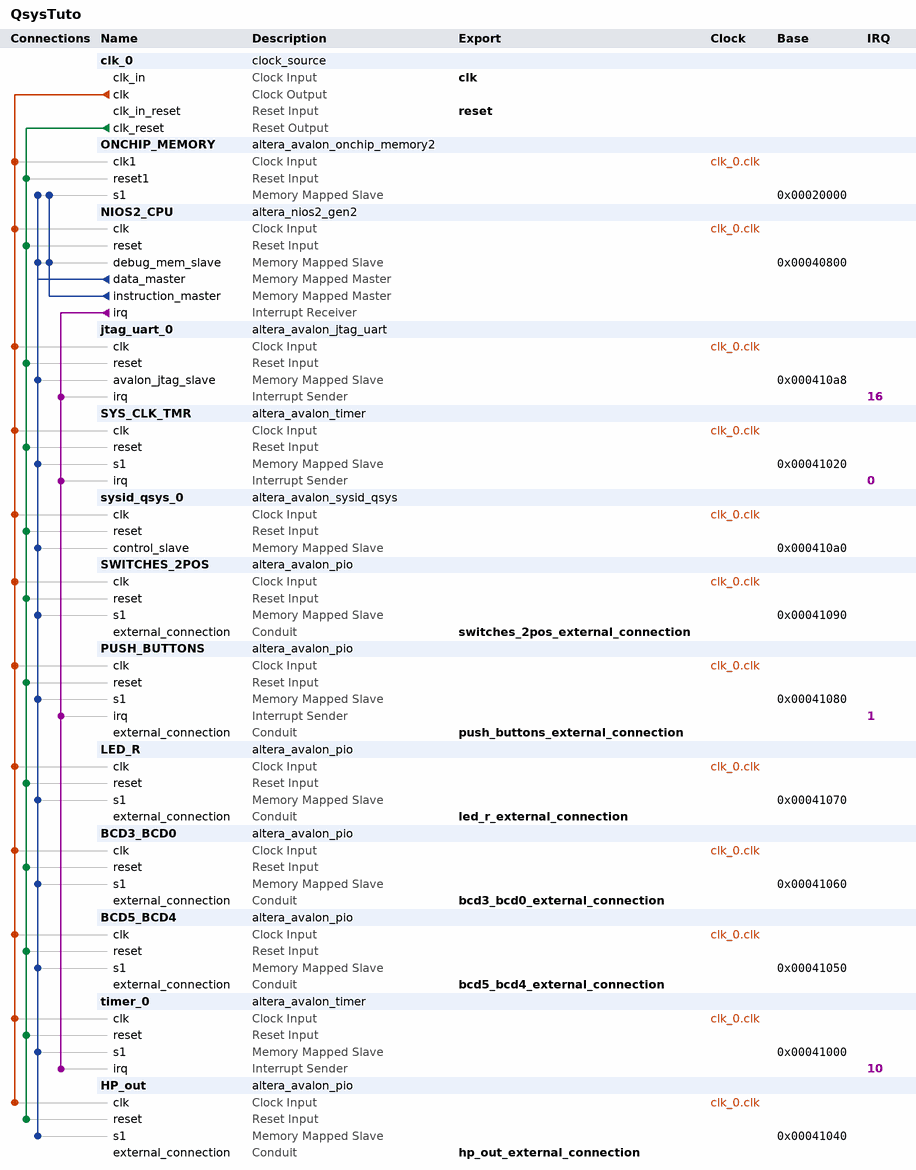
[diagram p0: system contents]
# Platform Designer (Qsys) system QsysTuto, MAX 10 10M50DAF484C6GES
# Parameters at their usual value, and those the tool derives, are not listed.
package require -exact qsys 18.1
create_system QsysTuto
set_project_property DEVICE_FAMILY {MAX 10}
set_project_property DEVICE 10M50DAF484C6GES

add_instance clk_0 clock_source 18.1
set_instance_parameter_value clk_0 clockFrequency 50000000

add_instance ONCHIP_MEMORY altera_avalon_onchip_memory2 18.1
set_instance_parameter_value ONCHIP_MEMORY dataWidth 32
set_instance_parameter_value ONCHIP_MEMORY dualPort false
set_instance_parameter_value ONCHIP_MEMORY initMemContent false
set_instance_parameter_value ONCHIP_MEMORY initializationFileName onchip_mem.hex
set_instance_parameter_value ONCHIP_MEMORY memorySize 122880

add_instance NIOS2_CPU altera_nios2_gen2 18.1
set_instance_parameter_value NIOS2_CPU dcache_size 0
set_instance_parameter_value NIOS2_CPU exceptionSlave ONCHIP_MEMORY.s1
set_instance_parameter_value NIOS2_CPU icache_size 2048
set_instance_parameter_value NIOS2_CPU impl Fast
set_instance_parameter_value NIOS2_CPU resetSlave ONCHIP_MEMORY.s1
set_instance_parameter_value NIOS2_CPU setting_branchpredictiontype Static

add_instance jtag_uart_0 altera_avalon_jtag_uart 18.1
set_instance_parameter_value jtag_uart_0 simInteractiveOptions NO_INTERACTIVE_WINDOWS

add_instance SYS_CLK_TMR altera_avalon_timer 18.1
set_instance_parameter_value SYS_CLK_TMR period 2
set_instance_parameter_value SYS_CLK_TMR periodUnits MSEC

add_instance sysid_qsys_0 altera_avalon_sysid_qsys 18.1
set_instance_parameter_value sysid_qsys_0 id -1430532899

add_instance SWITCHES_2POS altera_avalon_pio 18.1
set_instance_parameter_value SWITCHES_2POS direction Input
set_instance_parameter_value SWITCHES_2POS width 10

add_instance PUSH_BUTTONS altera_avalon_pio 18.1
set_instance_parameter_value PUSH_BUTTONS captureEdge true
set_instance_parameter_value PUSH_BUTTONS direction Input
set_instance_parameter_value PUSH_BUTTONS edgeType FALLING
set_instance_parameter_value PUSH_BUTTONS generateIRQ true
set_instance_parameter_value PUSH_BUTTONS irqType EDGE
set_instance_parameter_value PUSH_BUTTONS width 2

add_instance LED_R altera_avalon_pio 18.1
set_instance_parameter_value LED_R direction Output
set_instance_parameter_value LED_R resetValue 597
set_instance_parameter_value LED_R width 10

add_instance BCD3_BCD0 altera_avalon_pio 18.1
set_instance_parameter_value BCD3_BCD0 direction Output
set_instance_parameter_value BCD3_BCD0 resetValue 1077952576
set_instance_parameter_value BCD3_BCD0 width 32

add_instance BCD5_BCD4 altera_avalon_pio 18.1
set_instance_parameter_value BCD5_BCD4 direction Output
set_instance_parameter_value BCD5_BCD4 resetValue 16448
set_instance_parameter_value BCD5_BCD4 width 16

add_instance timer_0 altera_avalon_timer 18.1
set_instance_parameter_value timer_0 period 1
set_instance_parameter_value timer_0 periodUnits SEC

add_instance HP_out altera_avalon_pio 18.1
set_instance_parameter_value HP_out direction Output
set_instance_parameter_value HP_out width 1

# connections
add_connection clk_0.clk BCD3_BCD0.clk clock
add_connection clk_0.clk BCD5_BCD4.clk clock
add_connection clk_0.clk HP_out.clk clock
add_connection clk_0.clk jtag_uart_0.clk clock
add_connection clk_0.clk LED_R.clk clock
add_connection clk_0.clk NIOS2_CPU.clk clock
add_connection clk_0.clk ONCHIP_MEMORY.clk1 clock
add_connection clk_0.clk PUSH_BUTTONS.clk clock
add_connection clk_0.clk SWITCHES_2POS.clk clock
add_connection clk_0.clk SYS_CLK_TMR.clk clock
add_connection clk_0.clk sysid_qsys_0.clk clock
add_connection clk_0.clk timer_0.clk clock
add_connection clk_0.clk_reset BCD3_BCD0.reset reset
add_connection clk_0.clk_reset BCD5_BCD4.reset reset
add_connection clk_0.clk_reset HP_out.reset reset
add_connection clk_0.clk_reset jtag_uart_0.reset reset
add_connection clk_0.clk_reset LED_R.reset reset
add_connection clk_0.clk_reset NIOS2_CPU.reset reset
add_connection clk_0.clk_reset ONCHIP_MEMORY.reset1 reset
add_connection clk_0.clk_reset PUSH_BUTTONS.reset reset
add_connection clk_0.clk_reset SWITCHES_2POS.reset reset
add_connection clk_0.clk_reset SYS_CLK_TMR.reset reset
add_connection clk_0.clk_reset sysid_qsys_0.reset reset
add_connection clk_0.clk_reset timer_0.reset reset
add_connection NIOS2_CPU.data_master BCD3_BCD0.s1 avalon
set_connection_parameter_value NIOS2_CPU.data_master/BCD3_BCD0.s1 baseAddress 0x00041060
add_connection NIOS2_CPU.data_master BCD5_BCD4.s1 avalon
set_connection_parameter_value NIOS2_CPU.data_master/BCD5_BCD4.s1 baseAddress 0x00041050
add_connection NIOS2_CPU.data_master HP_out.s1 avalon
set_connection_parameter_value NIOS2_CPU.data_master/HP_out.s1 baseAddress 0x00041040
add_connection NIOS2_CPU.data_master jtag_uart_0.avalon_jtag_slave avalon
set_connection_parameter_value NIOS2_CPU.data_master/jtag_uart_0.avalon_jtag_slave baseAddress 0x000410a8
add_connection NIOS2_CPU.data_master LED_R.s1 avalon
set_connection_parameter_value NIOS2_CPU.data_master/LED_R.s1 baseAddress 0x00041070
add_connection NIOS2_CPU.data_master NIOS2_CPU.debug_mem_slave avalon
set_connection_parameter_value NIOS2_CPU.data_master/NIOS2_CPU.debug_mem_slave baseAddress 0x00040800
add_connection NIOS2_CPU.data_master ONCHIP_MEMORY.s1 avalon
set_connection_parameter_value NIOS2_CPU.data_master/ONCHIP_MEMORY.s1 baseAddress 0x00020000
add_connection NIOS2_CPU.data_master PUSH_BUTTONS.s1 avalon
set_connection_parameter_value NIOS2_CPU.data_master/PUSH_BUTTONS.s1 baseAddress 0x00041080
add_connection NIOS2_CPU.data_master SWITCHES_2POS.s1 avalon
set_connection_parameter_value NIOS2_CPU.data_master/SWITCHES_2POS.s1 baseAddress 0x00041090
add_connection NIOS2_CPU.data_master SYS_CLK_TMR.s1 avalon
set_connection_parameter_value NIOS2_CPU.data_master/SYS_CLK_TMR.s1 baseAddress 0x00041020
add_connection NIOS2_CPU.data_master sysid_qsys_0.control_slave avalon
set_connection_parameter_value NIOS2_CPU.data_master/sysid_qsys_0.control_slave baseAddress 0x000410a0
add_connection NIOS2_CPU.data_master timer_0.s1 avalon
set_connection_parameter_value NIOS2_CPU.data_master/timer_0.s1 baseAddress 0x00041000
add_connection NIOS2_CPU.instruction_master NIOS2_CPU.debug_mem_slave avalon
set_connection_parameter_value NIOS2_CPU.instruction_master/NIOS2_CPU.debug_mem_slave baseAddress 0x00040800
add_connection NIOS2_CPU.instruction_master ONCHIP_MEMORY.s1 avalon
set_connection_parameter_value NIOS2_CPU.instruction_master/ONCHIP_MEMORY.s1 baseAddress 0x00020000
add_connection NIOS2_CPU.irq jtag_uart_0.irq interrupt
set_connection_parameter_value NIOS2_CPU.irq/jtag_uart_0.irq irqNumber 16
add_connection NIOS2_CPU.irq PUSH_BUTTONS.irq interrupt
set_connection_parameter_value NIOS2_CPU.irq/PUSH_BUTTONS.irq irqNumber 1
add_connection NIOS2_CPU.irq SYS_CLK_TMR.irq interrupt
set_connection_parameter_value NIOS2_CPU.irq/SYS_CLK_TMR.irq irqNumber 0
add_connection NIOS2_CPU.irq timer_0.irq interrupt
set_connection_parameter_value NIOS2_CPU.irq/timer_0.irq irqNumber 10

# exported interfaces
add_interface bcd3_bcd0_external_connection conduit end
set_interface_property bcd3_bcd0_external_connection EXPORT_OF BCD3_BCD0.external_connection
add_interface bcd5_bcd4_external_connection conduit end
set_interface_property bcd5_bcd4_external_connection EXPORT_OF BCD5_BCD4.external_connection
add_interface clk clock sink
set_interface_property clk EXPORT_OF clk_0.clk_in
add_interface hp_out_external_connection conduit end
set_interface_property hp_out_external_connection EXPORT_OF HP_out.external_connection
add_interface led_r_external_connection conduit end
set_interface_property led_r_external_connection EXPORT_OF LED_R.external_connection
add_interface push_buttons_external_connection conduit end
set_interface_property push_buttons_external_connection EXPORT_OF PUSH_BUTTONS.external_connection
add_interface reset reset sink
set_interface_property reset EXPORT_OF clk_0.clk_in_reset
add_interface switches_2pos_external_connection conduit end
set_interface_property switches_2pos_external_connection EXPORT_OF SWITCHES_2POS.external_connection

set_interconnect_requirement {$system} qsys_mm.clockCrossingAdapter HANDSHAKE
set_interconnect_requirement {$system} qsys_mm.enableEccProtection FALSE
set_interconnect_requirement {$system} qsys_mm.insertDefaultSlave FALSE
set_interconnect_requirement {$system} qsys_mm.maxAdditionalLatency 1

save_system QsysTuto.qsys
